# EasyEDA schematic Schematic.json
TITLE: Universal LED Board; REV: 1.0; Date: 2024-07-10; Sheet: 1/1; Drawn By: Loewe_111; Company: Your Company
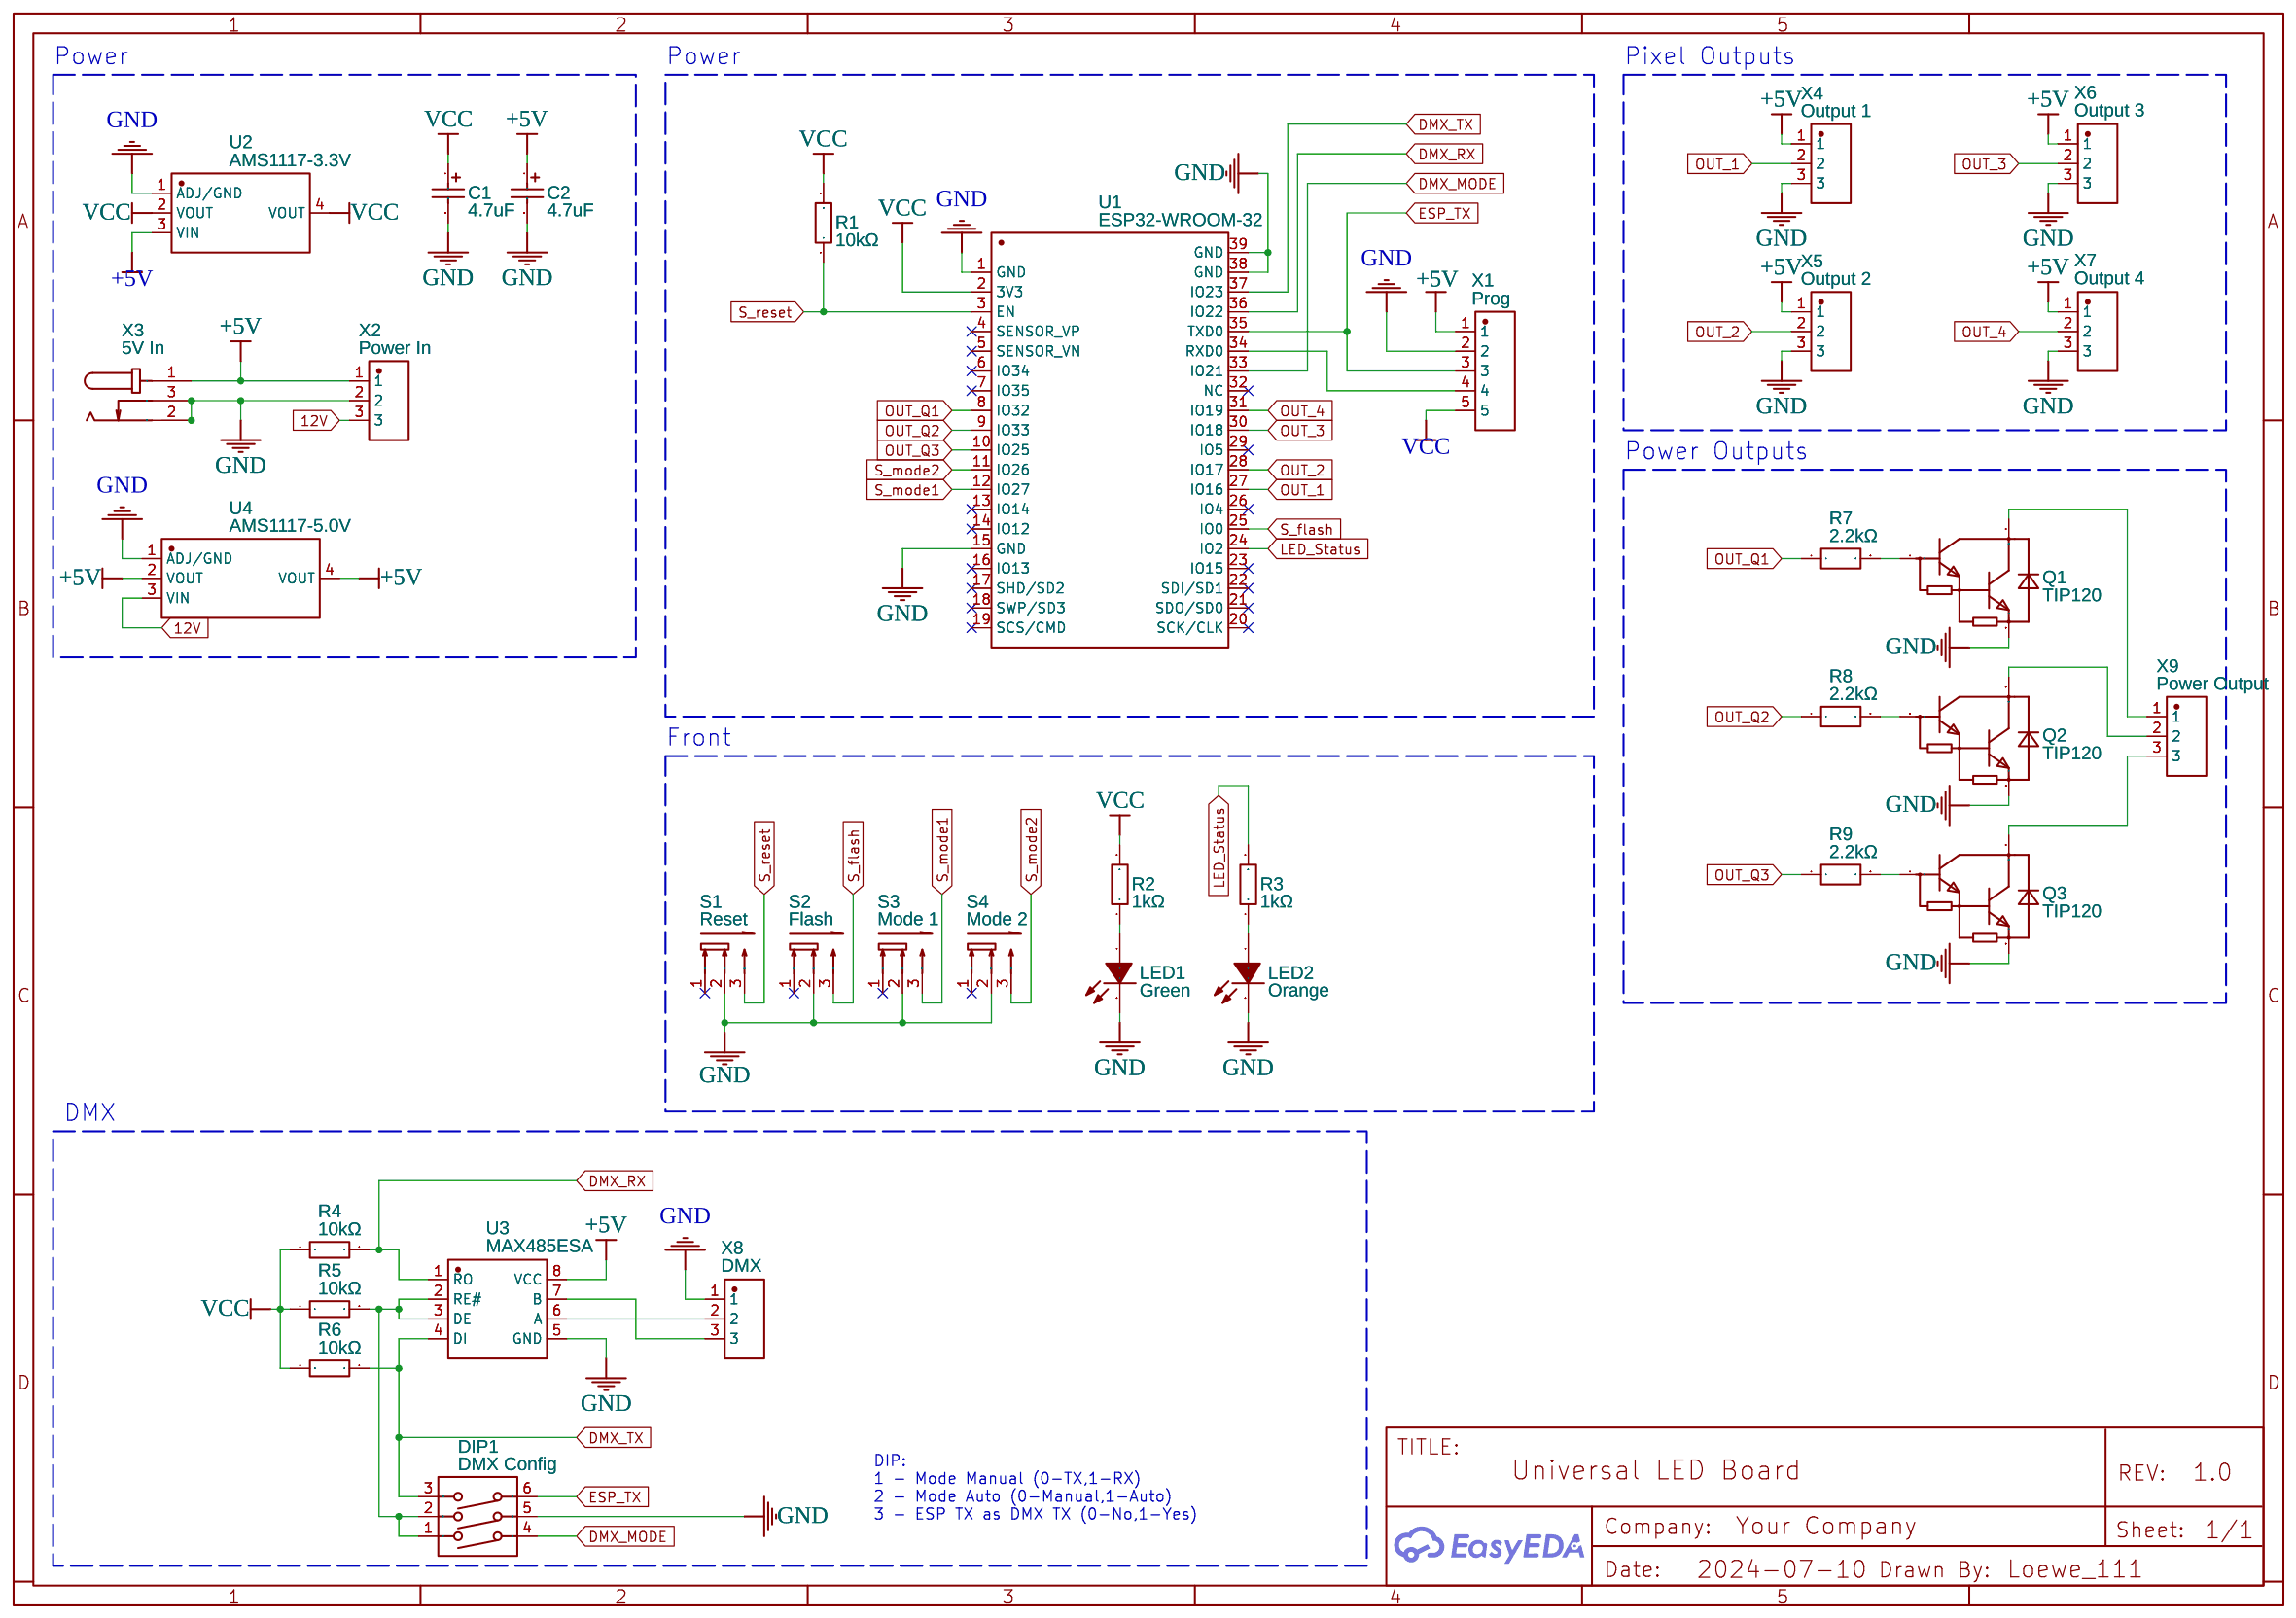
[diagram p0: schematic sheet]

## Parts
C1  4.7uF  [CASE-A_3216]
C2  4.7uF  [CASE-A_3216]
DIP1  DMX Config  [SW-TH_DSWB03LHGET]
LED1  Green  [LED0603-R-RD_GREEN]
LED2  Orange  [LED0603-R-RD_ORANGE]
Q1  TIP120  [TO-220-3_L10.0-W4.5-P2.54-L]
Q2  TIP120  [TO-220-3_L10.0-W4.5-P2.54-L]
Q3  TIP120  [TO-220-3_L10.0-W4.5-P2.54-L]
R1  10kΩ  [R0603]
R2  1kΩ  [R0603]
R3  1kΩ  [R0603]
R4  10kΩ  [R0603]
R5  10kΩ  [R0603]
R6  10kΩ  [R0603]
R7  2.2kΩ  [R0603]
R8  2.2kΩ  [R0603]
R9  2.2kΩ  [R0603]
S1  Reset  [SW-TH_XKB5858-Z-C]
S2  Flash  [SW-TH_XKB5858-Z-C]
S3  Mode 1  [SW-TH_XKB5858-Z-C]
S4  Mode 2  [SW-TH_XKB5858-Z-C]
U1  ESP32-WROOM-32  [WIFIM-SMD_ESP32-WROOM-32-N4]
U2  AMS1117-3.3V  [SOT-223-4_L6.5-W3.5-P2.30-LS7.0-BR]
U3  MAX485ESA  [SOP-8_L4.9-W3.9-P1.27-LS6.0-BL]
U4  AMS1117-5.0V  [SOT-223-3_L6.5-W3.4-P2.30-LS7.0-BR]
X1  Prog  [CONN-TH_5P-P2.50_ZX-XH2.54-5PZZ]
X2  Power In  [CONN-TH_DB128L-5.08-3P_1]
X3  5V In  [DC-IN-TH_DC-005-A200]
X4  Output 1  [CONN-TH_DB128L-5.08-3P_1]
X5  Output 2  [CONN-TH_DB128L-5.08-3P_1]
X6  Output 3  [CONN-TH_3P-P2.54_2501S-3P]
X7  Output 4  [CONN-TH_3P-P2.54_2501S-3P]
X8  DMX  [CONN-TH_3P-P2.54_2501S-3P]
X9  Power Output  [CONN-TH_DB128L-5.08-3P_1]

## Library data of the parts
C1 C2 = CA45-A-16V-4.7UF-K: Contributor: LCSC; Supplier: LCSC; Manufacturer: CEC(振华新云); Manufacturer Part: CA45-A-16V-4.7uF-K; Supplier Part: C129235; JLCPCB Part Class: Extended Part
DIP1 = DSWB03LHGET: Contributor: LCSC; Supplier: LCSC; Supplier Part: C99420; Manufacturer: YE; JLCPCB Part Class: Extended Part
LED1 = SZYY0603G: Contributor: LCSC; Supplier: LCSC; Supplier Part: C434420; Manufacturer: yongyu(永裕光电); JLCPCB Part Class: Extended Part
LED2 = SZYY0603O: Contributor: LCSC; Supplier: LCSC; Supplier Part: C434425; Manufacturer: yongyu(永裕光电); JLCPCB Part Class: Extended Part
Q1-Q3 = TIP120: Contributor: LCSC; Supplier: LCSC; Supplier Part: C262990; Manufacturer: ST(意法半导体); JLCPCB Part Class: Extended Part
R1 R4-R6 = 0603WAF1002T5E: Supplier: LCSC; Manufacturer: UNI-ROYAL(厚声); Supplier Part: C25804; JLCPCB Part Class: Basic Part
R2 R3 = RC0603FR-071KL: Supplier: LCSC; Manufacturer: YAGEO(国巨); Supplier Part: C22548; JLCPCB Part Class: Extended Part
R7-R9 = FRC0603J222 TS: Contributor: lcsc; Supplier: LCSC; Supplier Part: C2907117; Manufacturer: FOJAN(富捷); JLCPCB Part Class: Extended Part
S1-S4 = XKB5858-W-C: Contributor: LCSC; Supplier: LCSC; Supplier Part: C318869; Manufacturer: XKB Connection(中国星坤); JLCPCB Part Class: Extended Part
U1 = ESP32-WROOM-32: Contributor: LCSC; Supplier: LCSC; Supplier Part: C82899; Manufacturer: ESPRESSIF(乐鑫); Manufacturer Part: ESP32-WROOM-32-N4; JLCPCB Part Class: Extended Part
U2 = AMS1117-3.3V: Contributor: LCSC; Supplier: LCSC; Supplier Part: C2688239; Manufacturer: WPMtek(维攀); JLCPCB Part Class: Extended Part
U3 = MAX485ESA: Contributor: LCSC; Supplier: LCSC; Supplier Part: C2687394; Manufacturer: JSMSEMI(杰盛微); Manufacturer Part: max485ESA
U4 = AMS1117-5.0_C2909825: Contributor: LCSC; Supplier: LCSC; Supplier Part: C2909825; Manufacturer: WPMtek(维攀); Manufacturer Part: AMS1117-5.0; JLCPCB Part Class: Extended Part
X1 = ZX-XH2.54-5PZZ: Supplier: LCSC; Supplier Part: C7429635; Manufacturer: Megastar(兆星); JLCPCB Part Class: Extended Part; Contributor: lcsc
X2 X4 X5 X9 = DB128L-5.08-3P: Contributor: LCSC; Supplier: LCSC; Supplier Part: C395869; Manufacturer: DORABO(地博电气); Manufacturer Part: DB128L-5.08-3P-GN-S; JLCPCB Part Class: Extended Part
X3 = DC-005-A200: Contributor: LCSC; Supplier: LCSC; Supplier Part: C720557; Manufacturer: XUNPU(讯普); JLCPCB Part Class: Extended Part
X6-X8 = ZX-XH2.54-3PZZ: Contributor: lcsc; Supplier: LCSC; Supplier Part: C7429633; Manufacturer: Megastar(兆星); JLCPCB Part Class: Extended Part

## Nets
12V: U4.3(VIN) X2.3
+5V: C2.1 U2.3(VIN) U3.8(VCC) U4.2(VOUT) U4.4(VOUT) X1.1 X2.1 X3.1 X4.1 X5.1 X6.1 X7.1
GND: C1.2 C2.2 DIP1.5 LED1.2(-) LED2.2(-) Q1.3(E) Q2.3(E) Q3.3(E) S1.2 S2.2 S3.2 S4.2 U1.1(GND) U1.15(GND) U1.38(GND) U1.39(GND) U2.1(ADJ/GND) U3.5(GND) U4.1(ADJ/GND) X1.2 X2.2 X3.2 X3.3 X4.3 X5.3 X6.3 X7.3 X8.1
VCC: C1.1 R1.2 R2.2 R4.2 R5.1 R6.2 U1.2(3V3) U2.2(VOUT) U2.4(VOUT) X1.5
DMX_MODE: DIP1.4 U1.33(IO21)
DMX_RX: R4.1 U1.36(IO22) U3.1(RO)
DMX_TX: DIP1.3 R6.1 U1.37(IO23) U3.4(DI)
ESP_TX: DIP1.6 U1.35(TXD0) X1.3
LED_Status: R3.2 U1.24(IO2)
OUT_1: U1.27(IO16) X4.2
OUT_2: U1.28(IO17) X5.2
OUT_3: U1.30(IO18) X6.2
OUT_4: U1.31(IO19) X7.2
OUT_Q1: R7.1 U1.8(IO32)
OUT_Q2: R8.1 U1.9(IO33)
OUT_Q3: R9.1 U1.10(IO25)
S_flash: S2.3 U1.25(IO0)
S_mode1: S3.3 U1.12(IO27)
S_mode2: S4.3 U1.11(IO26)
S_reset: R1.1 S1.3 U1.3(EN)
Net-(DIP1-1): DIP1.1 DIP1.2 R5.2 U3.2(RE#) U3.3(DE)
Net-(LED1-1): LED1.1(+) R2.1
Net-(LED2-1): LED2.1(+) R3.1
Net-(Q1-1): Q1.1(B) R7.2
Net-(Q1-2): Q1.2(C) X9.1
Net-(Q2-1): Q2.1(B) R8.2
Net-(Q2-2): Q2.2(C) X9.2
Net-(Q3-1): Q3.1(B) R9.2
Net-(Q3-2): Q3.2(C) X9.3
Net-(U1-34): U1.34(RXD0) X1.4
Net-(U3-6): U3.6(A) X8.2
Net-(U3-7): U3.7(B) X8.3

Not connected (* = marked no-connect by the designer): S1 1*; S2 1*; S3 1*; S4 1*; U1 4(SENSOR_VP)* 5(SENSOR_VN)* 6(IO34)* 7(IO35)* 13(IO14)* 14(IO12)* 16(IO13)* 17(SHD/SD2)* 18(SWP/SD3)* 19(SCS/CMD)* 20(SCK/CLK)* 21(SDO/SD0)* 22(SDI/SD1)* 23(IO15)* 26(IO4)* 29(IO5)* 32(NC)*

## Notes on the sheet
- Power
- Power
- Pixel Outputs
- Power Outputs
- Front
- DMX
- DIP:
  1 - Mode Manual (0-TX,1-RX)
  2 - Mode Auto (0-Manual,1-Auto)
  3 - ESP TX as DMX TX (0-No,1-Yes)
